# EAGLE design miniPSU (EAGLE 7.1.0)
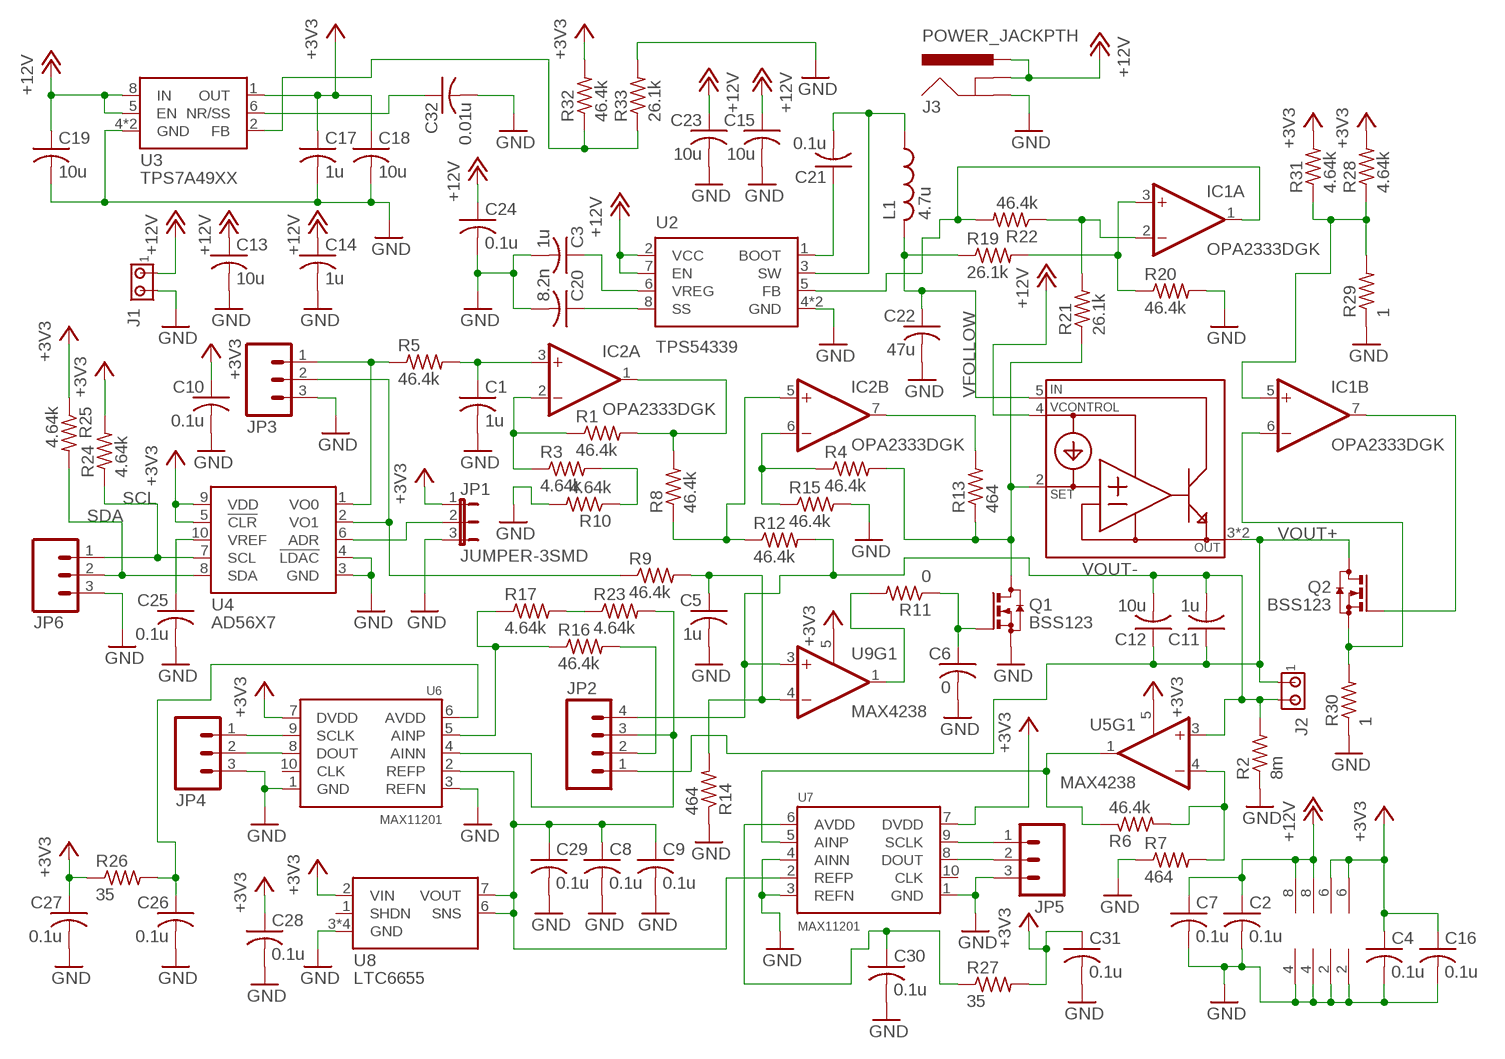
[diagram p0: schematic, sheet 1]

## Parts
C1  1u  C-USC0603  [C0603]
C2  0.1u  C-USC0603  [C0603]
C3  1u  C-USC0603  [C0603]
C4  0.1u  C-USC0603  [C0603]
C5  1u  C-USC0603  [C0603]
C6  0  C-USC0603  [C0603]
C7  0.1u  C-USC0603  [C0603]
C8  0.1u  C-USC0603  [C0603]
C9  0.1u  C-USC0603  [C0603]
C10  0.1u  C-USC0603  [C0603]
C11  1u  C-USC0603  [C0603]
C12  10u  C-USC1206  [C1206]
C13  10u  C-USC1206  [C1206]
C14  1u  C-USC0603  [C0603]
C15  10u  C-USC1206  [C1206]
C16  0.1u  C-USC0603  [C0603]
C17  1u  C-USC0603  [C0603]
C18  10u  C-USC1206  [C1206]
C19  10u  C-USC1206  [C1206]
C20  8.2n  C-USC0603  [C0603]
C21  0.1u  C-USC0603  [C0603]
C22  47u  C-USC1210  [C1210]
C23  10u  C-USC1206  [C1206]
C24  0.1u  C-USC0603  [C0603]
C25  0.1u  C-USC0603  [C0603]
C26  0.1u  C-USC0603  [C0603]
C27  0.1u  C-USC0603  [C0603]
C28  0.1u  C-USC0603  [C0603]
C29  0.1u  C-USC0603  [C0603]
C30  0.1u  C-USC0603  [C0603]
C31  0.1u  C-USC0603  [C0603]
C32  0.01u  C-USC0603  [C0603]
IC1  OPA2333DGK  [MSOP08]
IC2  OPA2333DGK  [MSOP08]
J1  MTA02-156  [1X2MTA]
J2  MTA02-156  [1X2MTA]
J3  POWER_JACKPTH  [POWER_JACK_PTH]
JP1  JUMPER-3SMD  [SJ_3]
JP2  M04LOCK  [1X04_LOCK]
JP3  M03LOCK  [1X03_LOCK]
JP4  M03LOCK  [1X03_LOCK]
JP5  M03LOCK  [1X03_LOCK]
JP6  M03LOCK  [1X03_LOCK]
L1  4.7u  L-USXAL4000  [XAL4000]
Q1  BSS123  [SOT23]
Q2  BSS123  [SOT23]
R1  46.4k  R-US0603  [C0603]
R2  8m  R-US1206  [C1206]
R3  4.64k  R-US0603  [C0603]
R4  46.4k  R-US0603  [C0603]
R5  46.4k  R-US0603  [C0603]
R6  46.4k  R-US0603  [C0603]
R7  464  R-US0603  [C0603]
R8  46.4k  R-US0603  [C0603]
R9  46.4k  R-US0603  [C0603]
R10  4.64k  R-US0603  [C0603]
R11  0  R-US0603  [C0603]
R12  46.4k  R-US0603  [C0603]
R13  464  R-US0603  [C0603]
R14  464  R-US0603  [C0603]
R15  46.4k  R-US0603  [C0603]
R16  46.4k  R-US0603  [C0603]
R17  4.64k  R-US0603  [C0603]
R19  26.1k  R-US0603  [C0603]
R20  46.4k  R-US0603  [C0603]
R21  26.1k  R-US0603  [C0603]
R22  46.4k  R-US0603  [C0603]
R23  4.64k  R-US0603  [C0603]
R24  4.64k  R-US0603  [C0603]
R25  4.64k  R-US0603  [C0603]
R26  35  R-US0603  [C0603]
R27  35  R-US0603  [C0603]
R28  4.64k  R-US0603  [C0603]
R29  1  R-US0603  [C0603]
R30  1  R-US0603  [C0603]
R31  4.64k  R-US0603  [C0603]
R32  46.4k  R-US0603  [C0603]
R33  26.1k  R-US0603  [C0603]
U1  LT3083-Q  [D2PAK-5]
U2  TPS54339  [SO-08-PAD]
U3  TPS7A49XX  [MSOP-8]
U4  AD56X7  [S-PDSO-G10]
U5  MAX4238  [SOT23-6]
U6  MAX11201  [S-PDSO-G10]
U7  MAX11201  [S-PDSO-G10]
U8  LTC6655  [MSOP-8-NOPAD]
U9  MAX4238  [SOT23-6]

## Nets
+3V3: C4.1 C10.1 C16.1 C17.1 C18.1 C27.1 C28.1 C31.1 JP1.1 R24.2 R25.1 R26.1 R27.2 R28.2 R31.2 R32.2 U3.1(OUT) U4.5(!CLR) U4.9(VDD) U5.5(EN) U5.6(V+) U6.7(DVDD) U7.7(DVDD) U8.2(VIN) U9.5(EN) U9.6(V+)
+12V: C2.1 C7.1 C13.1 C14.1 C15.1 C19.1 C23.1 C24.1 IC1.8(P:V+) IC2.8(P:V+) J1.1 J3.GNDBREAK J3.PWR U1.4(VCONTROL) U2.2(VCC) U2.7(EN) U3.5(EN) U3.8(IN)
GND: C1.2 C2.2 C3.2 C4.2 C5.2 C6.2 C7.2 C8.2 C9.2 C10.2 C13.2 C14.2 C15.2 C16.2 C17.2 C18.2 C19.2 C20.2 C22.2 C23.2 C24.2 C25.2 C26.2 C27.2 C28.2 C29.2 C30.2 C31.2 C32.2 IC1.4(P:V-) IC2.4(P:V-) J1.2 J3.GND JP1.3 JP3.3 JP4.3 JP5.3 JP6.3 Q1.2(S) R2.1 R7.1 R10.2 R14.1 R15.2 R20.2 R29.1 R30.1 R33.2 U2.4(GND) U2.PAD(GND) U3.4(GND) U3.TH(GND) U4.3(GND) U4.4(!LDAC) U5.2(V-) U6.1(GND) U6.3(REFN) U7.1(GND) U7.3(REFN) U7.4(AINN) U8.3(GND) U8.4(GND) U8.5(GND) U8.8(GND) U9.2(V-)
N$1: C32.1 U3.6(NR/SS)
N$2: C26.1 R26.2 U6.6(AVDD)
N$3: C1.1 IC2.3(A:+IN) R5.2
N$4: R6.2 R7.2 U5.4(-IN)
N$5: R6.1 U5.1(OUT) U7.5(AINP)
N$6: C5.1 R9.2 R14.2 U9.4(-IN)
N$7: R11.2 U9.1(OUT)
N$8: Q1.3(D) R4.2 R13.1 R21.1 U1.2(SET)
N$9: IC2.2(A:-IN) R1.1 R3.1
N$10: IC2.7(B:OUT) R13.2
N$11: IC2.1(A:OUT) R1.2 R8.2
N$13: IC2.5(B:+IN) R8.1 R12.1
N$14: IC2.6(B:-IN) R4.1 R15.1
N$15: C3.1 U2.6(VREG)
N$16: JP3.1 R5.1 U4.1(VO0)
N$17: JP3.2 R9.1 U4.2(VO1)
N$18: C20.1 U2.8(SS)
N$19: C6.1 Q1.1(G) R11.1
N$20: C30.1 R27.1 U7.6(AVDD)
N$21: IC1.1(A:OUT) R22.2 U2.5(FB)
N$22: IC1.3(A:+IN) R19.2 R20.1
N$23: IC1.2(A:-IN) R21.2 R22.1
N$24: JP1.2 U4.6(ADR)
N$25: C25.1 U4.10(VREF)
N$26: R3.2 R10.1
N$27: R17.2 R23.1
N$28: IC1.7(B:OUT) Q2.1(G)
N$29: R16.1 R17.1 U6.5(AINP)
N$30: IC1.5(B:+IN) R28.1 R29.2 R31.1
N$31: IC1.6(B:-IN) Q2.2(S) R30.2
N$32: C21.1 U2.1(BOOT)
N$33: C21.2 L1.P$1 U2.3(SW)
N$35: JP2.2 R16.2
N$36: JP2.3 R23.2 U6.4(AINN)
N$37: JP4.2 U6.8(DOUT)
N$38: C8.1 C9.1 C29.1 U6.2(REFP) U7.2(REFP) U8.6(SNS) U8.7(VOUT)
N$39: JP4.1 U6.9(SCLK)
N$40: JP5.2 U7.8(DOUT)
N$41: JP5.1 U7.9(SCLK)
N$42: R32.1 R33.1 U3.2(FB)
SCL: JP6.1 R24.1 U4.7(SCL)
SDA: JP6.2 R25.2 U4.8(SDA)
VFOLLOW: C22.1 L1.P$2 R19.1 U1.5(IN)
VOUT+: C11.1 C12.1 J2.1 JP2.1 Q2.3(D) U1.3(OUT) U1.PAD(OUT)
VOUT-: C11.2 C12.2 J2.2 JP2.4 R2.2 R12.2 U5.3(+IN) U9.3(+IN)
Unconnected: U6.10(CLK) U7.10(CLK) U8.1(SHDN)

## Library data of the parts
C1-C32 = GT-IEEE:C-US: CAPACITOR, American symbol
IC1 IC2 = linear:OPA2333: DUAL 1.8V, microPOWER CMOS OPERATIONAL AMPLIFIERS Zerø-Drift Series Source: Texas Instruments (Burr-Brown) .. U11 opa333 Operational Amp.pdf
J1 J2 = con-amp:MTA02-156: AMP connector
J3 = SparkFun-Connectors:POWER_JACK: Power Jack This is the standard 5.5mm barrel jack for power. The PTH is the most common, proven, reliable, footprint. The Slot footprint only works if the mill layer is transmitted to the PCB fab house so be warned. Spark Fun Electronics SKU : PRT-00119 SMT: CONN-08106 Mating wall wart : TOL-00298 (and others)
JP1 = SparkFun:JUMPER-3
JP2 = SparkFun-Connectors:M04: Header 4 Standard 4-pin 0.1" header. Use with straight break away headers (SKU : PRT-00116), right angle break away headers (PRT-00553), swiss pins (PRT-00743), machine pins (PRT-00117), and female headers (PRT-00115). Molex polarized connector foot print use with SKU : PRT-08231 with associated crimp pins and housings. 1MM SMD Version SKU: PRT-10208
JP3-JP6 = SparkFun-Connectors:M03: Header 3 Standard 3-pin 0.1" header. Use with straight break away headers (SKU : PRT-00116), right angle break away headers (PRT-00553), swiss pins (PRT-00743), machine pins (PRT-00117), and female headers (PRT-00115). Molex polarized connector foot print use with SKU : PRT-08232 with associated crimp pins and housings.
L1 = GT-IEEE:L-US
Q1 Q2 = transistor-small-signal:BSS123: N-CHANNEL MOS FET
R1-R17 R19-R33 = GT-IEEE:R-US
U1 = GT-IEEE:LT3083
U2 = GT-IEEE:TPS54339
U3 = GT-IEEE:TPS7A49XX
U4 = GT-IEEE:AD56X7
U5 U9 = GT-IEEE:MAX4238
U6 U7 = GT-IEEE:MAX11201
U8 = GT-IEEE:LTC6655

## Board
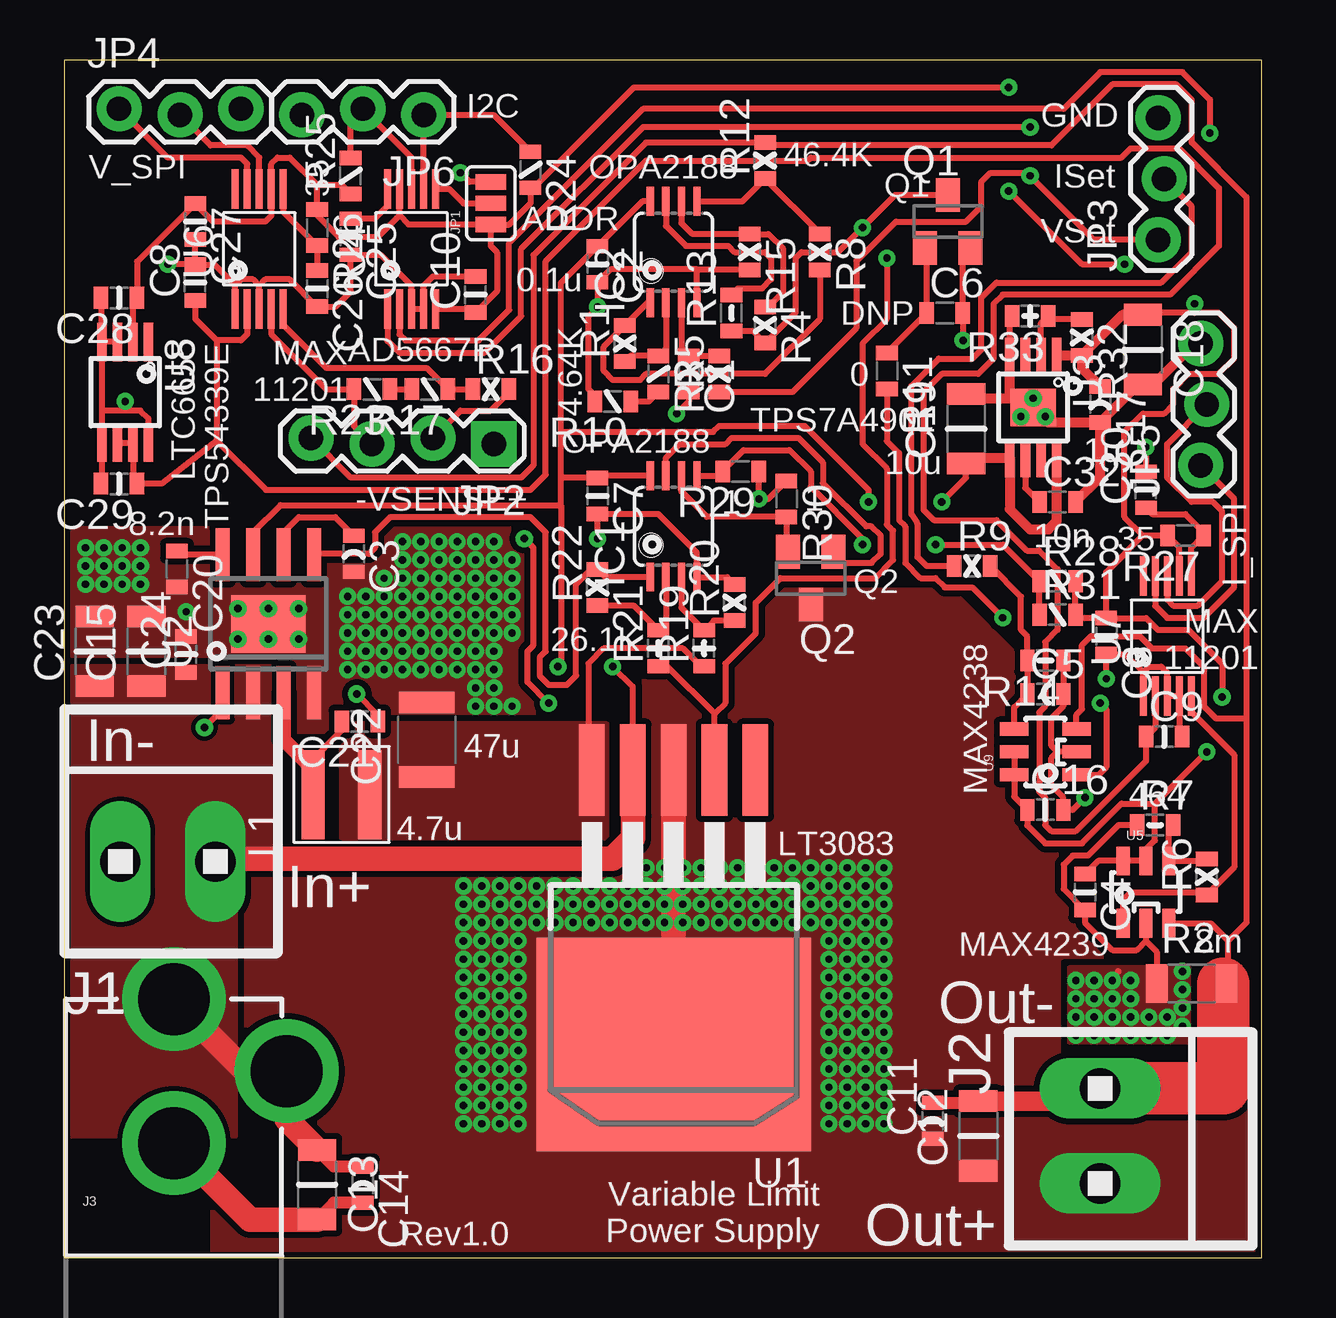
[diagram p1: board, top side]
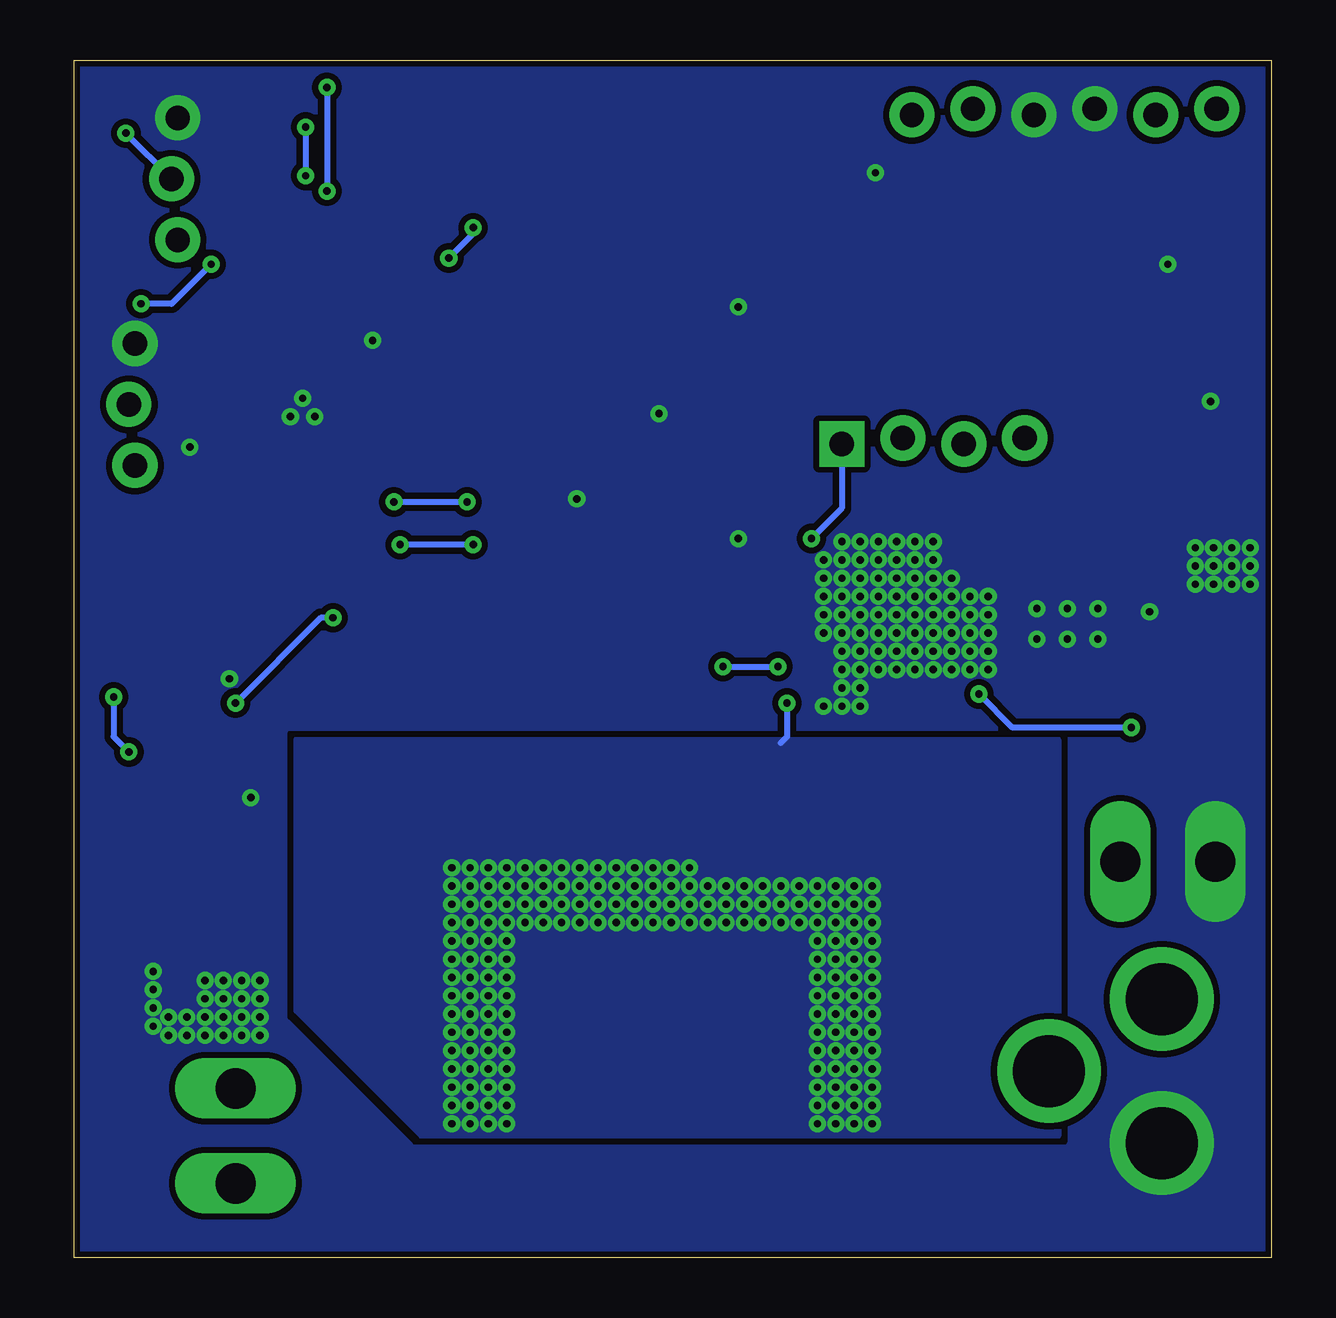
[diagram p2: board, bottom side, seen from below]

Size 49.91 x 49.91 mm. Coordinates in mm from the lower left corner, seen from the top.
Outline: 0,0 49.91,0 49.91,49.91 0,49.91 0,0
Copper layers (1*16): Top 0.035mm / dielectric 1.5mm / Bottom 0.035mm
Design rules "default *": minimum track width 10mil, minimum drill 12mil, track to track 8mil, track to pad 8mil, pad to pad 8mil, via to via 8mil, smd to smd 8mil, copper to edge 10mil, drill to drill 8mil, minimum pad ring 10mil, minimum via ring 8mil, stop-mask expansion 2mil, vias tented up to drill 13mil, thermal gap 10mil
tRestrict: 1 lines

### Footprints (pad centres in the part's own frame; a part is rotated, then mirrored left to right if it is on the bottom)
C0603 = smd 0.6 x 0.9: 1 -0.75,0; 2 0.75,0
C1206 = smd 0.9 x 1.6: 1 -1.45,0; 2 1.45,0
C1210 = smd 0.9 x 2.3: 1 -1.55,0; 2 1.55,0
MSOP08 = smd 0.3 x 1.2: 1 -0.976,-2.113; 2 -0.326,-2.113; 3 0.324,-2.113; 4 0.974,-2.113; 5 0.974,2.112; 6 0.324,2.112; 7 -0.326,2.112; 8 -0.976,2.112
1X2MTA = drill 1.676 long: 1 1.981,0; 2 -1.981,0
POWER_JACK_PTH = drill 2.997 pad 4.318: GND 0,7.7; GNDBREAK 4.7,10.7; PWR 0,13.7
SJ_3 = smd 0.635 x 1.27: 1 -0.889,0; 2 0,0; 3 0.889,0
1X04_LOCK = drill 1.016 pad 1.88 square: 1 0,0.127 | drill 1.016 pad 1.88: 2 2.54,-0.127; 3 5.08,0.127; 4 7.62,-0.127
1X03_LOCK = drill 1.016 pad 1.88: 1 0,0.127; 2 2.54,-0.127; 3 5.08,0.127
XAL4000 = smd 3.708 x 0.965: P$1 0,1.181; P$2 0,-1.181
SOT23 = smd 1 x 1.4: 1 -0.95,-1.1; 2 0.95,-1.1; 3 0,1.1
D2PAK-5 = smd 1.067 x 3.81: 1 -3.404,-7.62; 2 -1.702,-7.62; 3 0,-7.62; 4 1.702,-7.62; 5 3.404,-7.62 | smd 11.43 x 8.89: PAD 0,3.81
SO-08-PAD = smd 0.6 x 2.2: 1 -1.905,-2.875; 2 -0.635,-2.875; 3 0.635,-2.875; 4 1.905,-2.875; 5 1.905,2.875; 6 0.635,2.875; 7 -0.635,2.875; 8 -1.905,2.875 | smd 3.1 x 2.4: PAD 0,0
MSOP-8 = smd 0.4 x 1.6: 1 -0.975,-2.1; 2 -0.325,-2.1; 3 0.325,-2.1; 4 0.975,-2.1; 5 0.975,2.1; 6 0.325,2.1; 7 -0.325,2.1; 8 -0.975,2.1 | smd 1.89 x 1.57: TH 0,0
S-PDSO-G10 = smd 0.296 x 1.65: 1 -1,-2.5; 2 -0.5,-2.5; 3 0,-2.5; 4 0.5,-2.5; 5 1,-2.5; 6 1,2.5; 7 0.5,2.5; 8 0,2.5; 9 -0.5,2.5; 10 -1,2.5
SOT23-6 = smd 0.55 x 1.2: 1 -0.95,-1.3; 2 0,-1.3; 3 0.95,-1.3; 4 0.95,1.3; 5 0,1.3; 6 -0.95,1.3
MSOP-8-NOPAD = smd 0.4 x 1.6: 1 -0.975,-2.1; 2 -0.325,-2.1; 3 0.325,-2.1; 4 0.975,-2.1; 5 0.975,2.1; 6 0.325,2.1; 7 -0.325,2.1; 8 -0.975,2.1

### Placement (x,y rotation side)
C1  26.04,36.83 270 top
C2  22.23,41.4 270 top
C3  12.06,29.34 270 top
C4  42.55,15.24 270 top
C5  40.89,23.5 0 top
C6  36.7,39.37 0 top
C7  22.23,31.75 270 top
C8  5.46,40.64 90 top
C9  45.85,21.72 0 top
C10  17.14,40.13 90 top
C11  36.2,5.71 90 top
C12  38.1,5.08 90 top
C13  10.54,3.05 270 top
C14  12.45,3.05 270 top
C15  3.43,25.27 90 top
C16  40.89,18.67 0 top
C17  43.18,35.56 270 top
C18  44.96,37.85 270 top
C19  37.59,34.54 90 top
C20  4.7,28.7 270 top
C21  12.32,22.35 180 top
C22  15.11,21.59 90 top
C23  1.27,25.27 90 top
C24  5.08,25.15 90 top
C25  11.94,42.55 270 top
C26  10.54,40.39 270 top
C27  5.46,43.18 270 top
C28  2.29,40.01 180 top
C29  2.29,32.26 180 top
C30  45.09,32 90 top
C31  43.43,25.91 270 top
C32  41.4,31.5 0 top
IC1  25.4,30.48 0 top
IC2  25.4,41.91 0 top
J1  4.32,16.51 0 top
J2  43.18,5.08 270 top
J3  4.57,-2.92 0 top
JP1  17.78,43.94 90 top
JP2  17.91,34.04 180 top
JP3  45.72,42.42 90 top
JP4  2.29,47.75 0 top
JP5  47.5,33.02 90 top
JP6  14.99,47.75 180 top
L1  11.56,19.3 90 top
Q1  36.83,43.18 0 top
Q2  31.11,28.32 180 top
R1  23.37,38.1 90 top
R2  46.99,11.43 0 top
R3  24.77,36.83 270 top
R4  29.21,38.86 270 top
R5  27.3,36.83 90 top
R6  47.62,15.88 90 top
R7  45.47,18.03 0 top
R8  31.5,41.91 270 top
R9  37.85,28.83 0 top
R10  22.86,35.69 180 top
R11  34.29,36.96 270 top
R12  29.21,45.72 90 top
R13  27.81,39.37 90 top
R14  40.89,24.89 180 top
R15  28.57,41.91 270 top
R16  17.78,36.2 0 top
R17  15.24,36.2 180 top
R19  26.67,25.4 90 top
R20  27.94,27.3 90 top
R21  24.77,25.4 90 top
R22  22.23,27.94 90 top
R23  12.83,36.2 180 top
R24  19.43,45.34 270 top
R25  11.94,45.09 90 top
R26  10.54,42.93 270 top
R27  46.74,30.1 180 top
R28  41.4,28.19 0 top
R29  28.19,32.77 180 top
R30  30.1,31.62 270 top
R31  41.4,26.8 0 top
R32  42.42,38.35 270 top
R33  40.26,39.24 180 top
U1  25.4,12.7 180 top
U2  8.51,26.42 0 top
U3  40.39,35.43 180 top
U4  14.48,42.04 0 top
U5  45.09,15.24 0 top
U6  8.13,42.04 0 top
U7  45.97,25.91 0 top
U8  2.54,36.07 180 top
U9  40.89,21.08 90 top

### Tracks (layer width: path | path; a pad name or v marks a point on that pad's centre or on a via)
+3V3  (via drill 0.3)
  Top 0.254: C4.1 43.09,16.54 U5.6 U5.5 45.09,17.02 45.47,17.4 45.47,18.92 | 5.47,43.94 C27.1 | JP1.1 17.78,42.16 18.03,41.91 18.03,40.27 C10.1 16.99,39.54 U4.5 | U8.2 2.87,39.83 C28.1 3.04,41.51 C27.1 | JP1.1 14.35,43.05 13.97,43.43 | 13.97,43.43 U4.9 | 10.54,44.7 R26.1 10.54,43.43 11.43,42.55 13.08,42.55 13.97,43.43 | 10.54,44.7 9.4,45.85 8.89,45.85 8.63,45.59 U6.7 8.63,43.43 8.38,43.18 6.21,43.18 C27.1 | U7.7 46.47,29.61 R27.2 44.96,30.1 | C31.1 43.43,28.57 44.96,30.1 | 10.54,44.7 11.57,44.7 R25.1 | JP1.1 18.54,43.05 19.43,43.94 R24.2 19.57,44.59 23.75,48.77 v39.37,48.77 | C31.1 45.1,26.66 45.59,26.16 46.86,26.16 48.26,24.77 v48.26,23.37 | 44.96,30.1 44.2,30.86 44.2,34.42 44.96,35.18 45.85,35.18 46.23,35.56 46.23,36.2 46.86,36.83 48.13,36.83 48.77,37.47 48.77,38.73 48.13,39.37 47.12,39.37 | v39.37,44.45 42.42,41.4 v44.2,41.4 | 47.12,39.37 45.03,39.37 C18.1 | v47.12,39.75 47.12,39.37 | 45.47,18.92 v47.62,21.08 | R28.2 R31.2 42.29,26.66 C31.1 | U9.5 U9.6 39.59,19.22 C16.1 40.14,18.02 40.89,17.27 42.42,17.27 44.07,18.92 45.47,18.92
  Top 0.406: U3.1 41.43,37.6 R32.2 | R32.2 42.42,37.07 C17.1 | C18.1 44.11,39.3 R32.2
  Bottom 0.254: v48.26,23.37 48.26,21.72 v47.62,21.08 | v39.37,48.77 v39.37,44.45 | v44.2,41.4 45.85,39.75 v47.12,39.75
+12V  (via drill 0.3)
  Top 0.254: IC1.8 22.32,32.59 C7.1 | 22.21,32.51 C7.1 | U2.7 7.87,30.23 9.02,31.37 20.7,31.37 | 37.83,33.33 C19.1 37.59,32.51 v36.58,31.5 | U1.4 23.7,23.8 v22.86,24.64 | IC2.8 24.09,44.02 C2.1 20.7,40.63 20.7,34.42 | 20.7,31.37 20.7,32.51 | 20.7,32.51 20.7,34.42 | C7.1 20.71,32.5 20.7,32.51 | 20.7,31.37 20.7,24.77 v20.57,24.64 | 20.7,34.42 27.05,34.42 27.3,34.67 30.86,34.67 33.53,32 v33.53,31.5
  Top 0.406: U3.8 41.36,30.69 41.02,30.35 40.26,30.35 39.41,31.2 U3.5 37.83,33.33
  Top 0.508: C14.1 11.24,3.8 C13.1
  Top 1.016: U1.4 23.7,17.48 22.86,16.64 6.22,16.64 | C13.1 9.27,5.77 J3.GNDBREAK 7.57,7.78 J3.PWR
  Bottom 0.254: v22.86,24.64 v20.57,24.64 | v36.58,31.5 v33.53,31.5
  pour Top (no thermals): 0,24.64 8.76,24.64 8.76,16.89 7.11,16.89 7.11,5.08 0,5.08
GND  (via drill 0.3)
  Top 0.254: IC2.4 26.37,41.19 | 43.93,11.95 43.94,11.94 | U5.2 45.09,13.21 | 45.09,13.21 45.54,12.75 R2.1 | R20.2 27.63,28.37 IC1.4 26.37,29.38 24.77,30.99 22.24,30.99 C7.2 v22.23,29.97 | U7.1 44.97,24.4 | 44.97,24.4 45.21,24.64 45.72,24.64 45.97,24.38 U7.3 U7.4 46.47,21.84 C9.2 | 44.97,24.4 44.22,25.16 C31.2 v43.43,24.13 | C8.2 C27.2 | U8.3 U8.4 | U8.4 1.56,39.98 C28.2 | C29.2 1.56,32.29 U8.5 1.56,35.31 | U8.4 1.56,35.31 | U8.8 3.52,34.97 3.17,35.31 2.54,35.31 | 2.54,35.31 1.56,35.31 | U6.1 7.13,40.53 | 7.13,40.53 7.37,40.77 7.87,40.77 8.13,40.51 | U6.3 8.13,40.51 | 8.13,40.51 8.38,40.77 9.4,40.77 C26.2 11.31,39.64 11.94,40.26 C25.2 13.2,41.8 14.48,40.51 U4.3 U4.4 14.98,40.51 15.36,40.88 C10.2 | C8.2 5.32,41.39 5.31,41.4 v4.32,41.4 | 45.09,13.21 44.7,12.83 43.69,12.83 42.55,13.97 C4.2 41.66,15.38 41.66,16.38 42.04,16.76 42.67,16.76 43.94,18.03 R7.1 | C1.2 26.04,35.69 v25.53,35.18 | 26.37,41.19 28.55,41.19 R15.2 | 26.37,41.19 22.76,41.19 C2.2 v22.23,39.62 21.84,39.24 21.84,36.2 22.11,35.93 R10.2 | U3.4 39.41,39.15 R33.2 | Q1.2 37.45,41.75 C6.2 37.45,38.24 v37.47,38.23 | C30.2 v45.09,33.78 | R29.1 28.96,32.75 v28.96,31.62 29.35,31.62 R30.1 | R14.1 C5.2 41.64,22.99 41.15,22.49 41.15,21.34 41.4,21.08 | U9.2 41.4,21.08 | 41.4,21.08 41.15,20.83 41.15,19.68 41.64,19.19 41.64,18.81 C16.2 42.04,18.67 v42.55,19.18 | v2.54,35.69 2.54,35.31 | JP1.3 16.89,44.83 v16.51,45.21 | C8.2 6.27,41.39 7.13,40.53
  Top 0.406: C17.2 44.77,36.4 C18.2 45.41,36.4 47.12,38.1 JP5.3 | C17.2 41.01,34.81 U3.TH 39.88,35.43 39.5,35.81 | C32.2 43.18,32.52 C17.2 | C19.2 37.77,35.81 39.5,35.81 | 39.5,35.81 39.41,35.9 U3.4
  Top 0.508: C14.2 11.24,2.3 C13.2
  Top 1.016: C13.2 7.75,1.6 J3.GND
  other vias: 46.61,11.94 46.61,11.18 46.61,10.41 46.61,9.65 45.97,10.03 45.97,9.27 45.21,9.27 45.21,10.03 44.45,10.79 44.45,11.56 43.69,11.56 43.69,10.79 44.45,10.03 44.45,9.27 43.69,9.27 43.69,10.03 42.93,10.03 42.93,9.27 42.16,9.27 42.16,10.03 42.16,10.79 42.93,10.79 42.93,11.56 42.16,11.56 0.89,28.07 0.89,28.83 0.89,29.59 1.65,29.59 1.65,28.83 1.65,28.07 2.41,28.07 2.41,28.83 2.41,29.59 3.17,29.59 3.17,28.83 3.17,28.07 5.08,26.92 11.81,27.56 11.81,26.8 11.81,26.04 11.81,25.27 11.81,24.51 12.57,24.51 12.57,25.27 12.57,26.04 12.57,26.8 12.57,27.56 13.34,27.56 13.34,28.32 13.34,26.8 13.34,26.04 13.34,25.27 13.34,24.51 14.1,24.51 14.1,25.27 14.1,26.04 14.1,26.8 14.1,27.56 14.1,28.32 14.1,29.08 14.1,29.84 14.86,29.84 15.62,29.84 16.38,29.84 17.14,29.84 17.91,29.84 17.91,29.08 18.67,29.08 18.67,28.32 18.67,27.56 18.67,26.8 18.67,26.04 17.91,26.04 17.91,26.8 17.91,27.56 17.91,28.32 17.91,25.27 17.91,24.51 17.91,23.75 17.91,22.99 18.67,22.99 17.14,22.99 17.14,23.75 17.14,24.51 16.38,24.51 14.86,24.51 15.62,24.51 14.86,25.27 14.86,26.04 14.86,26.8 14.86,27.56 14.86,28.32 14.86,29.08 15.62,29.08 16.38,29.08 17.14,29.08 17.14,28.32 17.14,27.56 17.14,26.8 17.14,26.04 17.14,25.27 15.62,25.27 16.38,25.27 16.38,26.04 15.62,26.04 15.62,26.8 16.38,26.8 15.62,27.56 16.38,27.56 16.38,28.32 15.62,28.32 8.51,27.05 8.51,25.78 7.24,27.05 7.24,25.78 9.78,25.78 9.78,27.05 40.89,35.05 39.88,35.05 40.39,35.81
  pour Top (isolate 0.254, no thermals): 46.86,12.06 41.91,12.06 41.91,9.02 46.86,9.02
  pour Bottom (isolate 0.254, rank 2, no thermals): 0,0 50,0 50,50 0,50
  pour Top (isolate 0.254, rank 2, no thermals): 0,21.97 20.19,21.97 20.19,30.35 0,30.35
N$1
  Top 0.254: U3.6 40.06,32.09 C32.1
N$2
  Top 0.254: C26.1 R26.2 9.13,43.59 U6.6
N$3
  Top 0.254: IC2.3 25.72,37.89 C1.1 R5.2
N$4
  Top 0.254: R7.2 46.03,17.85 U5.4 47.54,16.54 R6.2
N$5
  Top 0.254: U5.1 44.13,14.93 44.45,15.24 47.51,15.24 R6.1 48.77,16.27 48.77,20.95 46.97,22.75 U7.5
N$6
  Top 0.254: U9.4 39.59,22.95 C5.1 R14.2 40.14,25.9 39.88,26.16 39.88,27.55 R9.2
N$7  (via drill 0.3)
  Top 0.254: R11.2 34.29,34.04 34.8,33.53 34.8,30.73 35.05,30.48 35.05,28.96 35.69,28.32 36.32,28.32 36.7,27.94 37.85,27.94 v39.12,26.67 | v43.18,23.11 43.43,22.86 43.43,20.45 43.12,20.13 U9.1
  Bottom 0.254: v39.12,26.67 39.62,26.67 v43.18,23.11
N$8  (via drill 0.3)
  Top 0.254: U1.2 27.1,22.68 | R21.1 25.13,24.65 27.1,22.68 | Q1.3 34.63,44.28 v33.27,42.93 32.26,41.91 30.73,41.91 30.48,41.66 30.48,39.38 R4.2 28.7,38.62 R13.1 | 27.1,22.68 27.13,22.68 27.56,23.11 27.56,24.77 28.83,26.04 28.83,27.3 29.84,28.32 33.78,28.32 34.54,29.08 34.54,30.3 34.29,30.56 34.29,32.89 33.27,33.91 33.27,38.1 34.29,39.12 v34.29,41.66
  Bottom 0.254: v33.27,42.93 33.27,42.67 v34.29,41.66
N$9
  Top 0.254: IC2.2 25.07,37.89 R3.1 23.6,37.58 R1.1
N$10
  Top 0.254: IC2.7 25.07,43 25.91,42.16 27.69,42.16 27.94,41.91 29.21,41.91 29.46,41.66 29.46,40.77 29.08,40.39 28.08,40.39 R13.2
N$11
  Top 0.254: R8.2 31.5,39.12 29.21,36.83 24.26,36.83 24,36.58 22.86,36.58 22.48,36.96 22.48,37.96 R1.2 24.32,39.8 IC2.1
N$13
  Top 0.254: IC2.5 28.26,44.02 R12.1 31.5,42.68 R8.1
N$14
  Top 0.254: IC2.6 25.72,43.11 26.16,42.67 28.56,42.67 R15.1 29.35,42.66 29.97,42.04 29.97,40.26 29.32,39.61 R4.1
N$15
  Top 0.254: U2.6 9.14,30.23 9.78,30.86 11.29,30.86 C3.1
N$16  (via drill 0.3)
  Top 0.254: R5.1 30.36,36.08 33.02,38.73 33.02,41.53 34.67,43.18 37.59,43.18 38.23,43.81 38.23,44.83 38.61,45.21 40.13,45.21 v40.26,45.09 42.93,42.42 JP3.1 | U4.1 13.48,38.21 13.97,37.72 17.53,37.72 19.05,39.24 19.05,42.04 24.13,47.12 v40.26,47.12
  Bottom 0.254: v40.26,47.12 v40.26,45.09
N$17  (via drill 0.3)
  Top 0.254: JP3.2 46.99,43.81 46.99,41.91 45.72,40.64 38.86,40.64 38.23,40.01 38.23,37.85 37.85,37.47 36.45,37.47 35.31,36.32 35.31,30.99 35.56,30.61 35.56,29.21 35.94,28.83 R9.1 | U4.2 13.98,38.47 14.22,38.23 17.27,38.23 18.54,39.5 18.54,42.29 24.13,47.88 41.66,47.88 43.18,49.4 46.61,49.4 47.75,48.26 v47.75,46.86
  Bottom 0.254: JP3.2 v47.75,46.86
N$18
  Top 0.254: U2.8 4.86,29.29 C20.1
N$19
  Top 0.254: Q1.1 35.95,42.01 C6.1 R11.1
N$20
  Top 0.254: U7.6 46.97,29.59 R27.1 47.49,30.24 46.74,30.99 45.35,30.99 C30.1
N$21
  Top 0.254: IC1.1 22.55,28.37 R22.2 21.96,28.69 21.34,28.07 21.34,24.26 20.95,23.88 20.19,23.88 19.81,24.26 19.81,25.02 20.07,25.27 20.07,30.23 19.43,30.86 13.59,30.86 12.95,30.23 12.95,29.59 12.7,29.34 10.46,29.34 U2.5
N$22
  Top 0.254: IC1.3 25.72,27.1 R19.2 27.07,26.55 R20.1
N$23
  Top 0.254: R22.1 23.73,27.19 R21.2 25.07,26.46 IC1.2
N$24
  Top 0.254: U4.6 16.04,44.54 16.64,43.94 JP1.2
N$25
  Top 0.254: U4.10 13.48,43.83 12.94,43.3 C25.1
N$26
  Top 0.254: R10.1 24.37,35.69 R3.2
N$27
  Top 0.254: R23.1 R17.2
N$28
  Top 0.254: Q2.1 32.53,28.96 33.66,28.96 34.04,29.34 34.04,30.1 33.66,30.48 33.43,30.48 31.65,32.26 31.62,32.28 31.62,33.15 30.61,34.16 27.81,34.16 27.56,33.91 25.65,33.91 25.07,33.33 IC1.7
N$29
  Top 0.254: R16.1 R17.1 15.1,37.08 10.92,37.08 9.13,38.88 U6.5
N$30  (via drill 0.3)
  Top 0.254: R31.1 R28.1 39.13,29.72 v36.32,29.72 | IC1.5 27.27,32.59 R29.2 28.32,33.66 30.23,33.66 31.11,32.77 31.11,32.13 33.27,29.97 v33.27,29.72
  Bottom 0.254: v33.27,29.72 v36.32,29.72
N$31
  Top 0.254: Q2.2 30.1,29.49 R30.2 26.79,30.87 25.72,31.93 IC1.6
N$32  (via drill 0.3)
  Top 0.254: U2.1 6.6,22.86 v5.84,22.1 | C21.1 13.07,22.62 v12.19,23.5
  Bottom 0.254: v5.84,22.1 10.79,22.1 v12.19,23.5
N$33
  Top 0.254: C21.2 11.57,21.98 10.16,20.57
  Top 0.61: L1.P$1 10.38,20.36 10.16,20.57 9.14,21.59 U2.3
N$35
  Top 0.254: JP2.2 16.51,35.31 17.78,35.31 18.53,36.06 R16.2
N$36
  Top 0.254: JP2.3 12.08,34.66 R23.2 10.92,36.2 8.63,38.49 U6.4
N$37
  Top 0.254: U6.8 8.13,45.85 7.62,46.35 6.1,46.35 JP4.2
N$38
  Top 0.254: U8.6 U8.7 2.87,32.43 C29.1 4.06,32.26 6.36,34.05 | U6.2 7.63,38.49 7.37,38.23 6.36,38.23 | 6.36,38.23 6.36,34.05 | U7.2 45.47,22.09 C9.1 45.1,20.71 42.16,17.78 41.15,17.78 40.89,18.03 40.89,19.18 40.64,19.43 40.64,22.73 40.89,22.99 40.89,25.65 41.4,26.16 41.4,28.7 40.64,29.46 40.13,29.46 38.86,30.73 36.25,30.73 35.81,31.17 35.81,36.07 36.58,36.83 38.1,36.83 38.73,37.47 38.73,39.75 39.12,40.13 46.1,40.13 48.13,42.16 48.13,44.58 46.48,46.23 44.45,46.23 44.07,45.85 31.11,45.85 30.99,45.72 24.26,45.72 20.07,41.53 20.07,32.64 19.43,32 8.41,32 6.36,34.05 | C8.1 5.46,39.13 6.36,38.23
N$39
  Top 0.254: U6.9 7.63,45.59 7.37,45.85 4.32,45.85 JP4.1
N$40
  Top 0.254: U7.8 45.97,27.43 46.23,27.18 47.24,27.18 48.26,28.19 48.26,31.11 47.88,31.5 46.99,31.5 45.97,32.51 45.97,33.91 JP5.2
N$41
  Top 0.254: U7.9 45.47,27.17 45.97,26.67 47.5,26.67 48.77,27.94 48.77,31.62 JP5.1
N$42
  Top 0.254: R32.1 40.89,39.1 R33.1 40.71,38.95 U3.2
SCL
  Top 0.254: U4.7 14.98,47.62 JP6.1 17.89,47.62 R24.1
SDA
  Top 0.254: U4.8 14.48,45.85 JP6.2 11.94,47.37 R25.2
VFOLLOW
  Top 0.254: R19.1 26.53,24.65 25.78,25.4 22.48,25.4 21.84,24.77 21.84,21.34 | 21.97,20.34 U1.5
  pour Top (isolate 0.254, no thermals): 22.61,22.23 11.56,22.23 11.56,17.53 22.61,17.53
VOUT+  (via drill 0.3)
  Top 0.254: v20.19,23.11 19.3,24 19.3,25.27 19.56,25.53 19.56,29.59 v19.18,29.97
  Top 1.016: U1.3 25.4,12.06
  Bottom 0.254: JP2.1 17.91,31.24 v19.18,29.97 | v20.19,23.11 20.19,21.72 20.45,21.46
  other vias: 18.92,12.45 18.92,11.68 18.92,10.92 18.92,10.16 18.92,9.4 18.92,7.87 18.92,8.64 18.92,7.11 18.92,6.35 18.92,5.59 18.16,5.59 18.16,6.35 18.16,7.11 18.16,7.87 18.16,8.64 18.16,9.4 18.16,10.16 18.16,10.92 18.16,11.68 18.16,12.45 31.88,5.59 32.64,5.59 32.64,6.35 31.88,6.35 31.88,7.11 32.64,7.11 32.64,7.87 31.88,7.87 31.88,8.64 32.64,8.64 32.64,9.4 31.88,9.4 31.88,10.16 32.64,10.16 32.64,10.92 31.88,10.92 31.88,11.68 32.64,11.68 32.64,12.45 31.88,12.45 31.88,13.21 32.64,13.21 17.4,5.59 17.4,6.35 17.4,7.11 17.4,7.87 17.4,8.64 17.4,9.4 17.4,10.16 17.4,10.92 17.4,11.68 17.4,12.45 33.4,13.21 33.4,12.45 33.4,11.68 33.4,10.92 33.4,10.16 33.4,9.4 33.4,8.64 33.4,7.87 33.4,7.11 33.4,6.35 33.4,5.59 31.88,13.97 32.64,13.97 33.4,13.97 31.11,13.97 30.35,13.97 29.59,13.97 28.83,13.97 28.07,13.97 27.3,13.97 26.54,13.97 25.78,13.97 25.02,13.97 24.26,13.97 23.5,13.97 22.73,13.97 21.97,13.97 21.21,13.97 21.21,14.73 21.97,14.73 22.73,14.73 23.5,14.73 24.26,14.73 25.02,14.73 25.78,14.73 26.54,14.73 27.3,14.73 28.07,14.73 28.83,14.73 29.59,14.73 30.35,14.73 31.11,14.73 31.88,14.73 32.64,14.73 33.4,14.73 24.26,15.49 25.02,15.49 25.78,15.49 26.54,15.49 27.3,15.49 28.07,15.49 28.83,15.49 29.59,15.49 30.35,15.49 31.11,15.49 31.88,15.49 32.64,15.49 33.4,15.49 20.45,13.97 20.45,14.73 19.68,14.73 19.68,13.97 18.92,13.97 18.92,14.73 18.16,14.73 18.16,13.97 18.92,13.21 18.16,13.21 17.4,13.21 17.4,13.97 17.4,14.73 16.64,14.73 16.64,13.97 16.64,13.21 16.64,12.45 16.64,11.68 16.64,10.92 16.64,10.16 16.64,9.4 16.64,8.64 16.64,7.87 16.64,7.11 16.64,6.35 16.64,5.59 34.16,5.59 34.16,6.35 34.16,7.11 34.16,7.87 34.16,8.64 34.16,9.4 34.16,10.16 34.16,10.92 34.16,11.68 34.16,13.21 34.16,12.45 34.16,13.97 34.16,14.73 34.16,15.49 23.5,15.49 22.73,15.49 21.97,15.49 21.21,15.49 20.45,15.49 19.68,15.49 18.92,15.49 18.16,15.49 17.4,15.49 16.64,15.49 24.26,16.26 25.02,16.26 25.78,16.26 26.54,16.26 27.3,16.26 28.07,16.26 28.83,16.26 29.59,16.26 30.35,16.26 31.11,16.26 31.88,16.26 32.64,16.26 33.4,16.26 34.16,16.26
  pour Top (isolate 0.254, rank 5, no thermals): 6.22,22.35 21.21,22.35 26.67,27.81 36.96,27.81 49.91,14.86 49.91,0 6.22,0
  pour Bottom (isolate 0.254, no thermals): 8.89,5.08 35.43,5.08 40.64,10.29 40.64,21.59 8.89,21.59
VOUT-
  Top 0.254: 48.31,11.43 R2.2 48.51,11.5 48.51,13.21 | 49.28,22.48 49.28,44.2 46.99,46.48 46.99,48.26 46.35,48.9 43.69,48.9 41.15,46.35 29.32,46.35 R12.2 24.25,46.47 19.56,41.78 19.56,33.02 19.05,32.51 11.94,32.51 JP2.4 | 49.28,22.48 49.28,13.97 48.51,13.21 | U5.3 47.78,13.94 48.51,13.21 | U9.3 42.19,22.64 42.42,22.86 42.42,25.53 42.8,25.91 44.83,25.91 45.34,25.4 46.74,25.4 47.5,24.64 47.5,22.99 48.01,22.48 49.28,22.48
  Top 0.508: C11.2 38.03,6.46 C12.2
  Top 0.813: C12.2 43.92,6.53 J2.2
  Top 2.184: 48.31,11.43 48.31,7.06 J2.2

### Text on the board
_tsilk: I2C | GND | V_SPI | ISet | OPA2188 | 46.4K | 35 | ADDR | Q1 | VSet | 0.1u | DNP | AD5667R | MAX / 11201 | 0 | 4.64K | TPS7A4901 | OPA2188 | 10u | 1u | LTC6655 | -VSENSE+ | 1 | 1 | 10n | I_SPI | 8.2n | TPS54339E | 35 | Q2 | MAX / 11201 | 26.1K | In- | 47u | MAX4238 | 464 | 4.7u | LT3083 | In+ | MAX4239 | 8m | Out- | Rev1.0 | Variable Limit / Power Supply | Out+